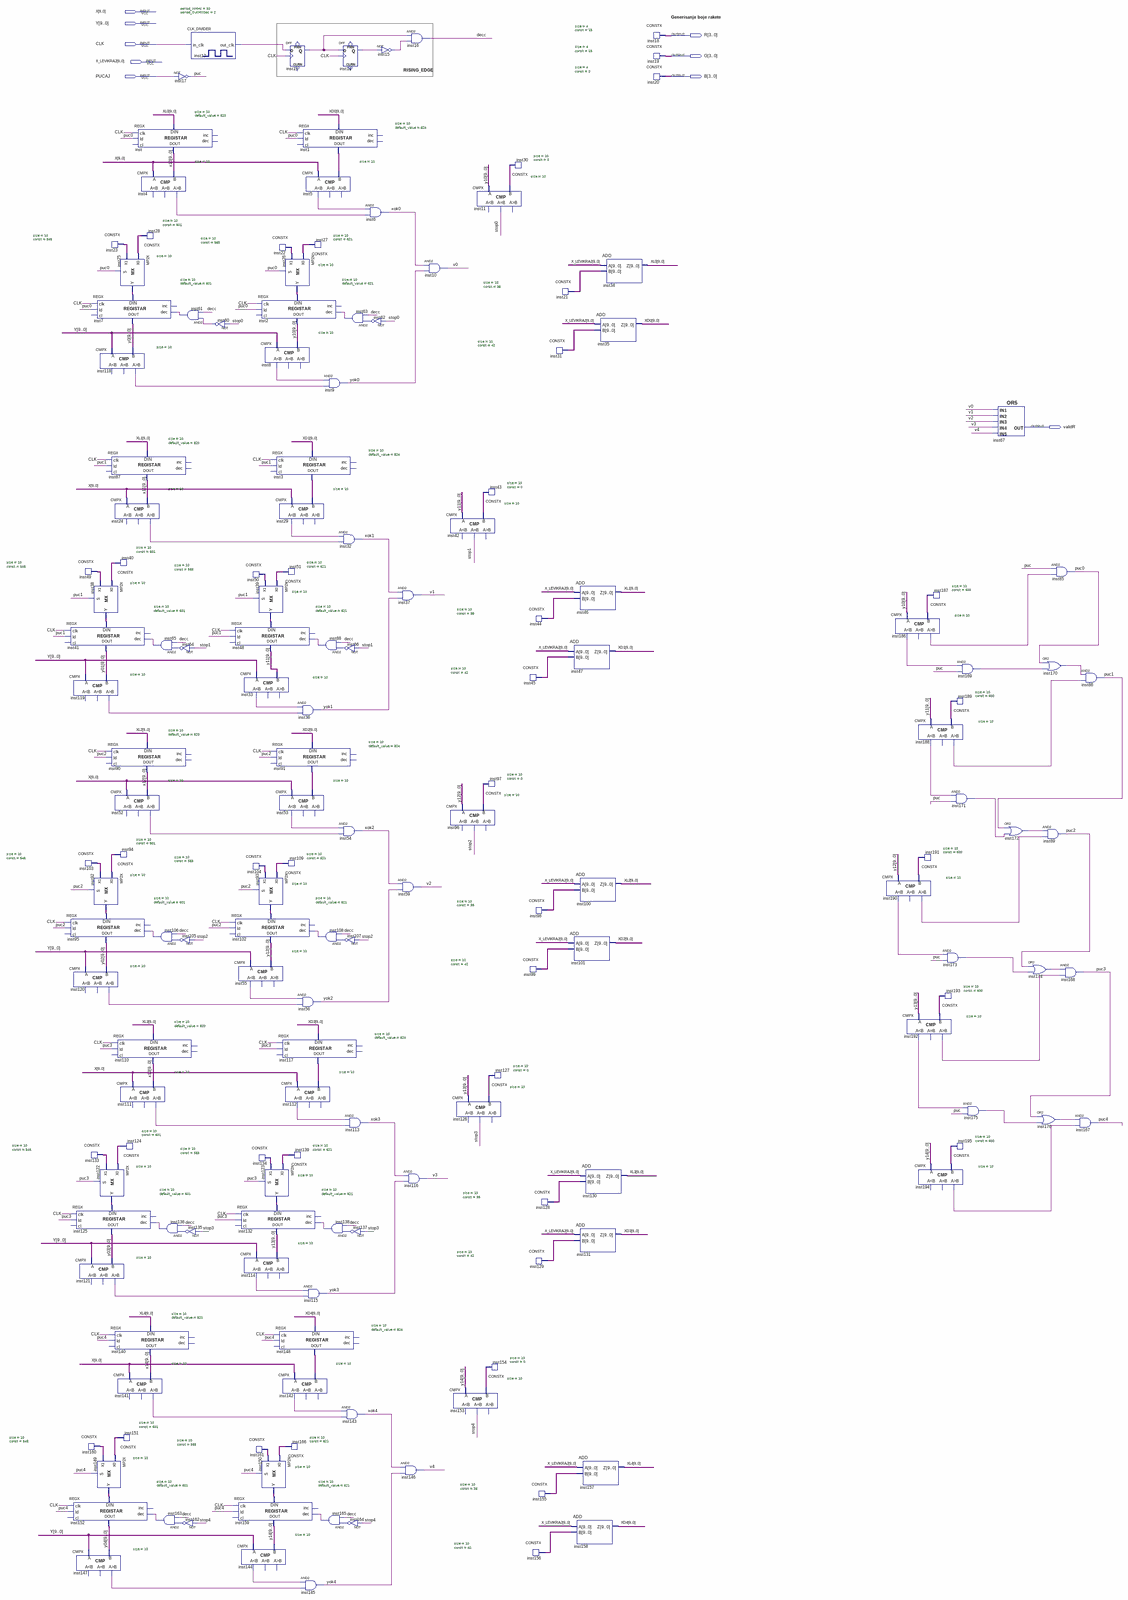
[diagram p0: schematic sheet, whole]
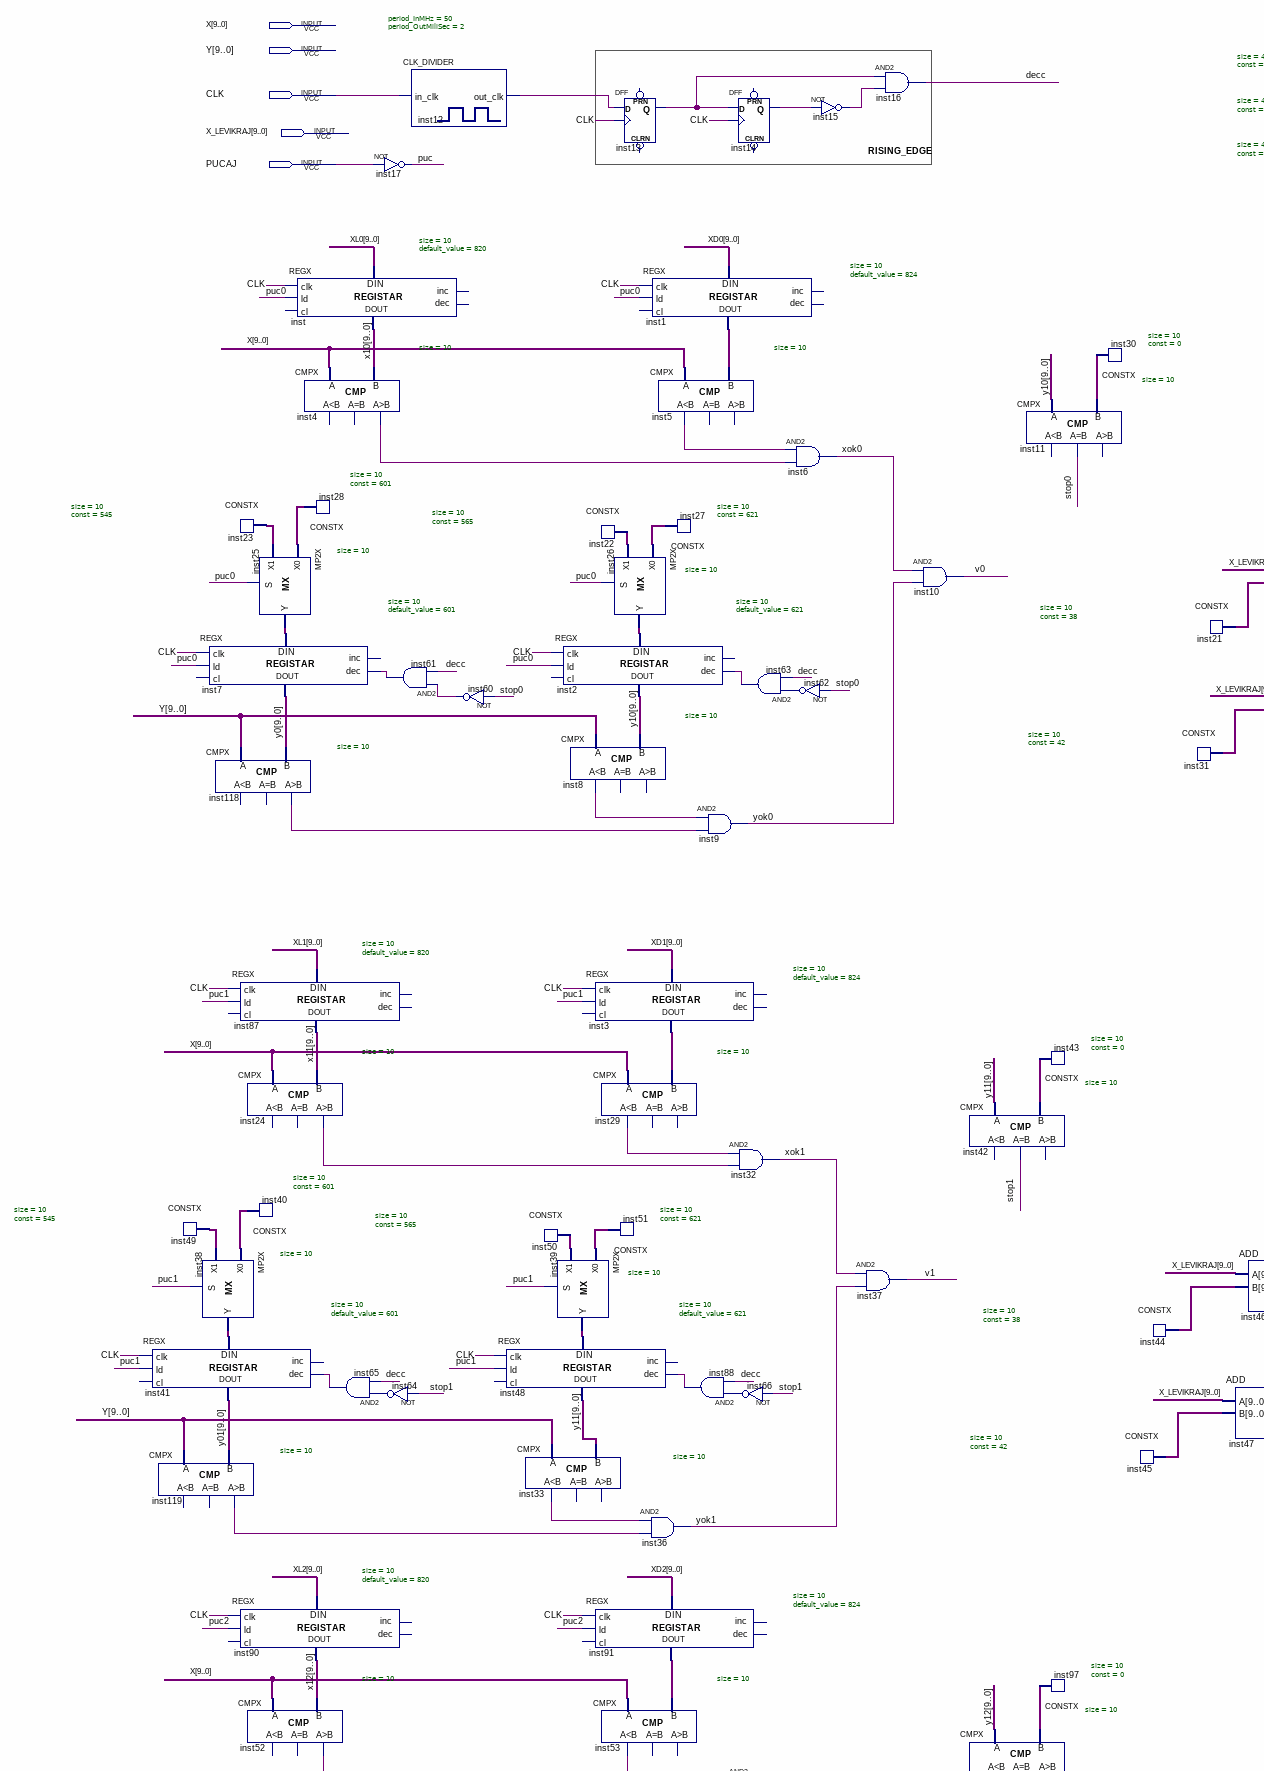
[diagram p1: schematic sheet, upper left part]
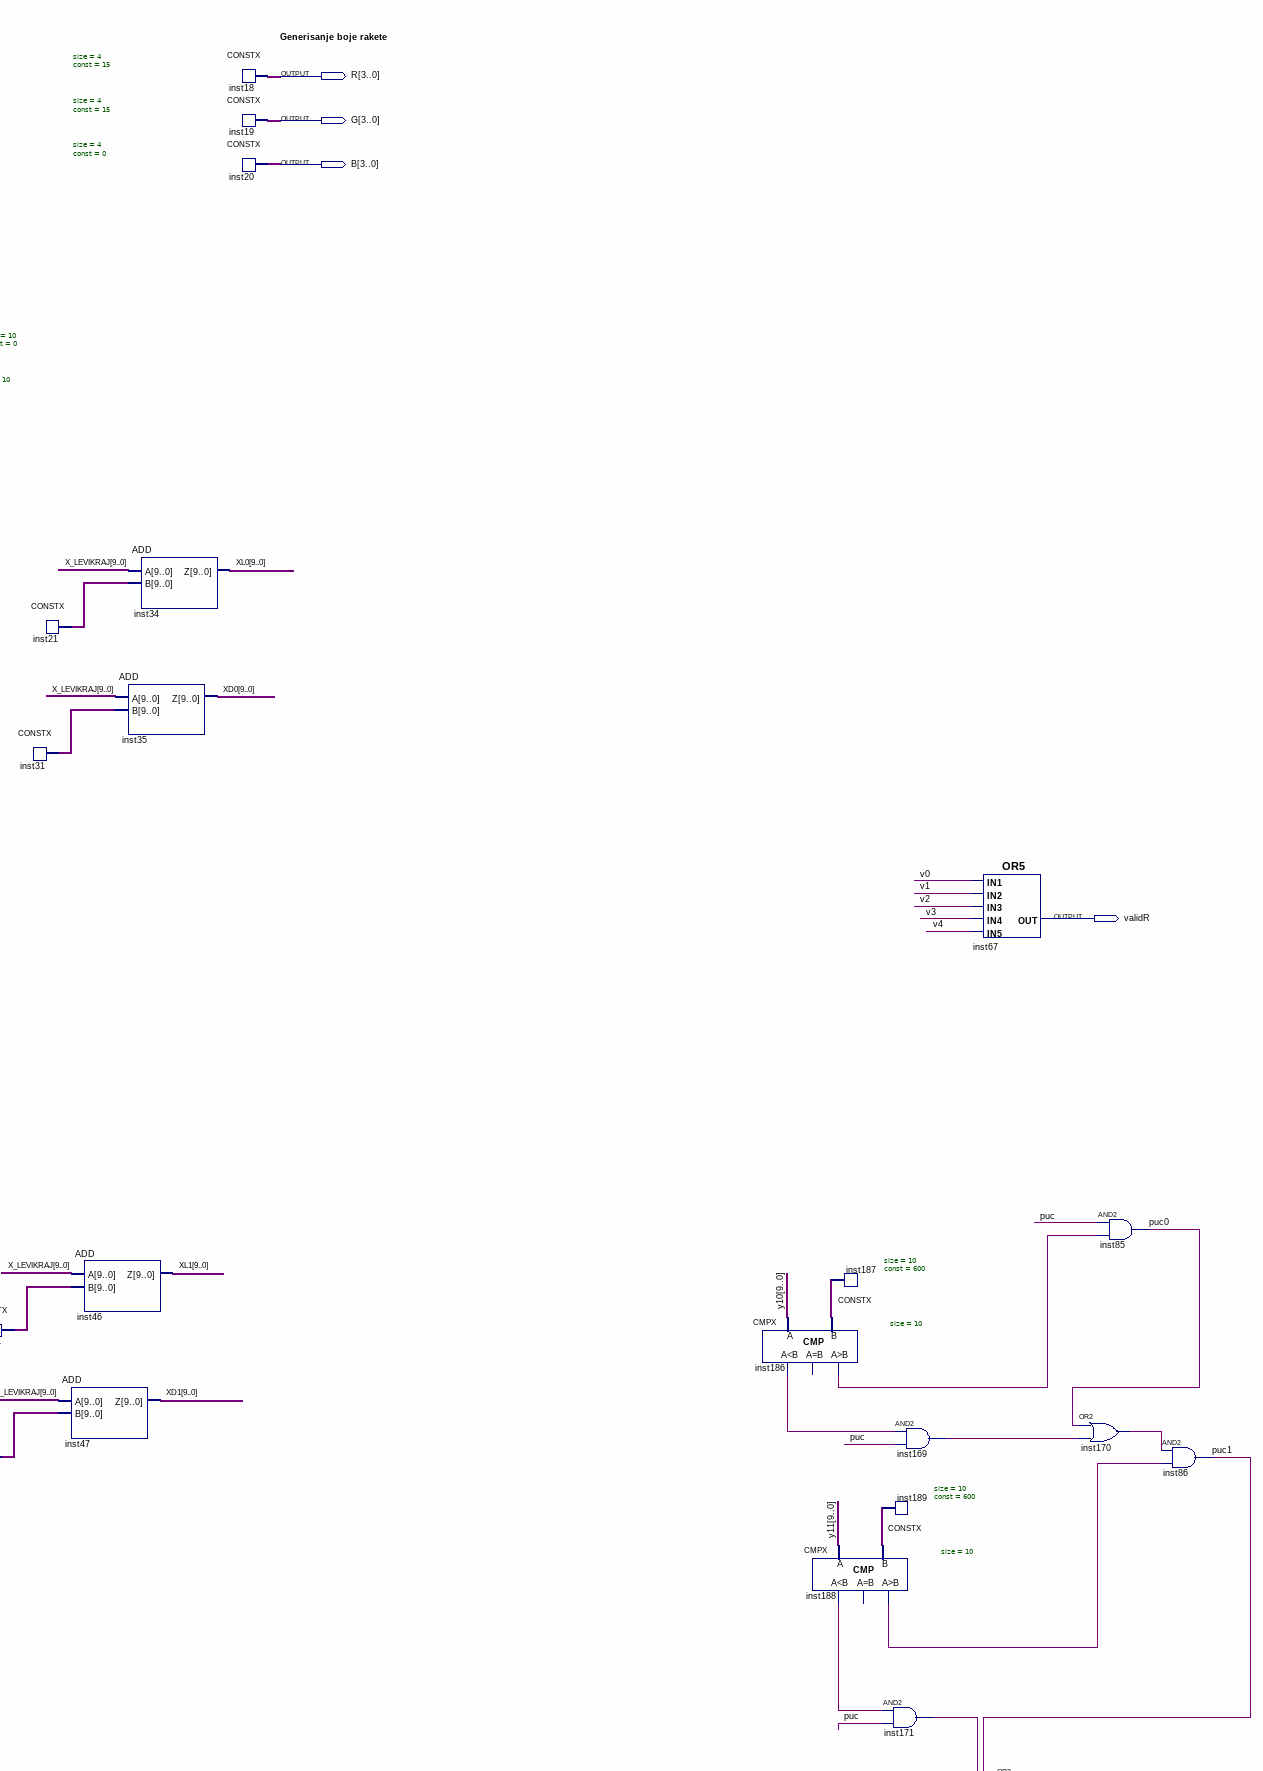
[diagram p2: schematic sheet, upper right part]
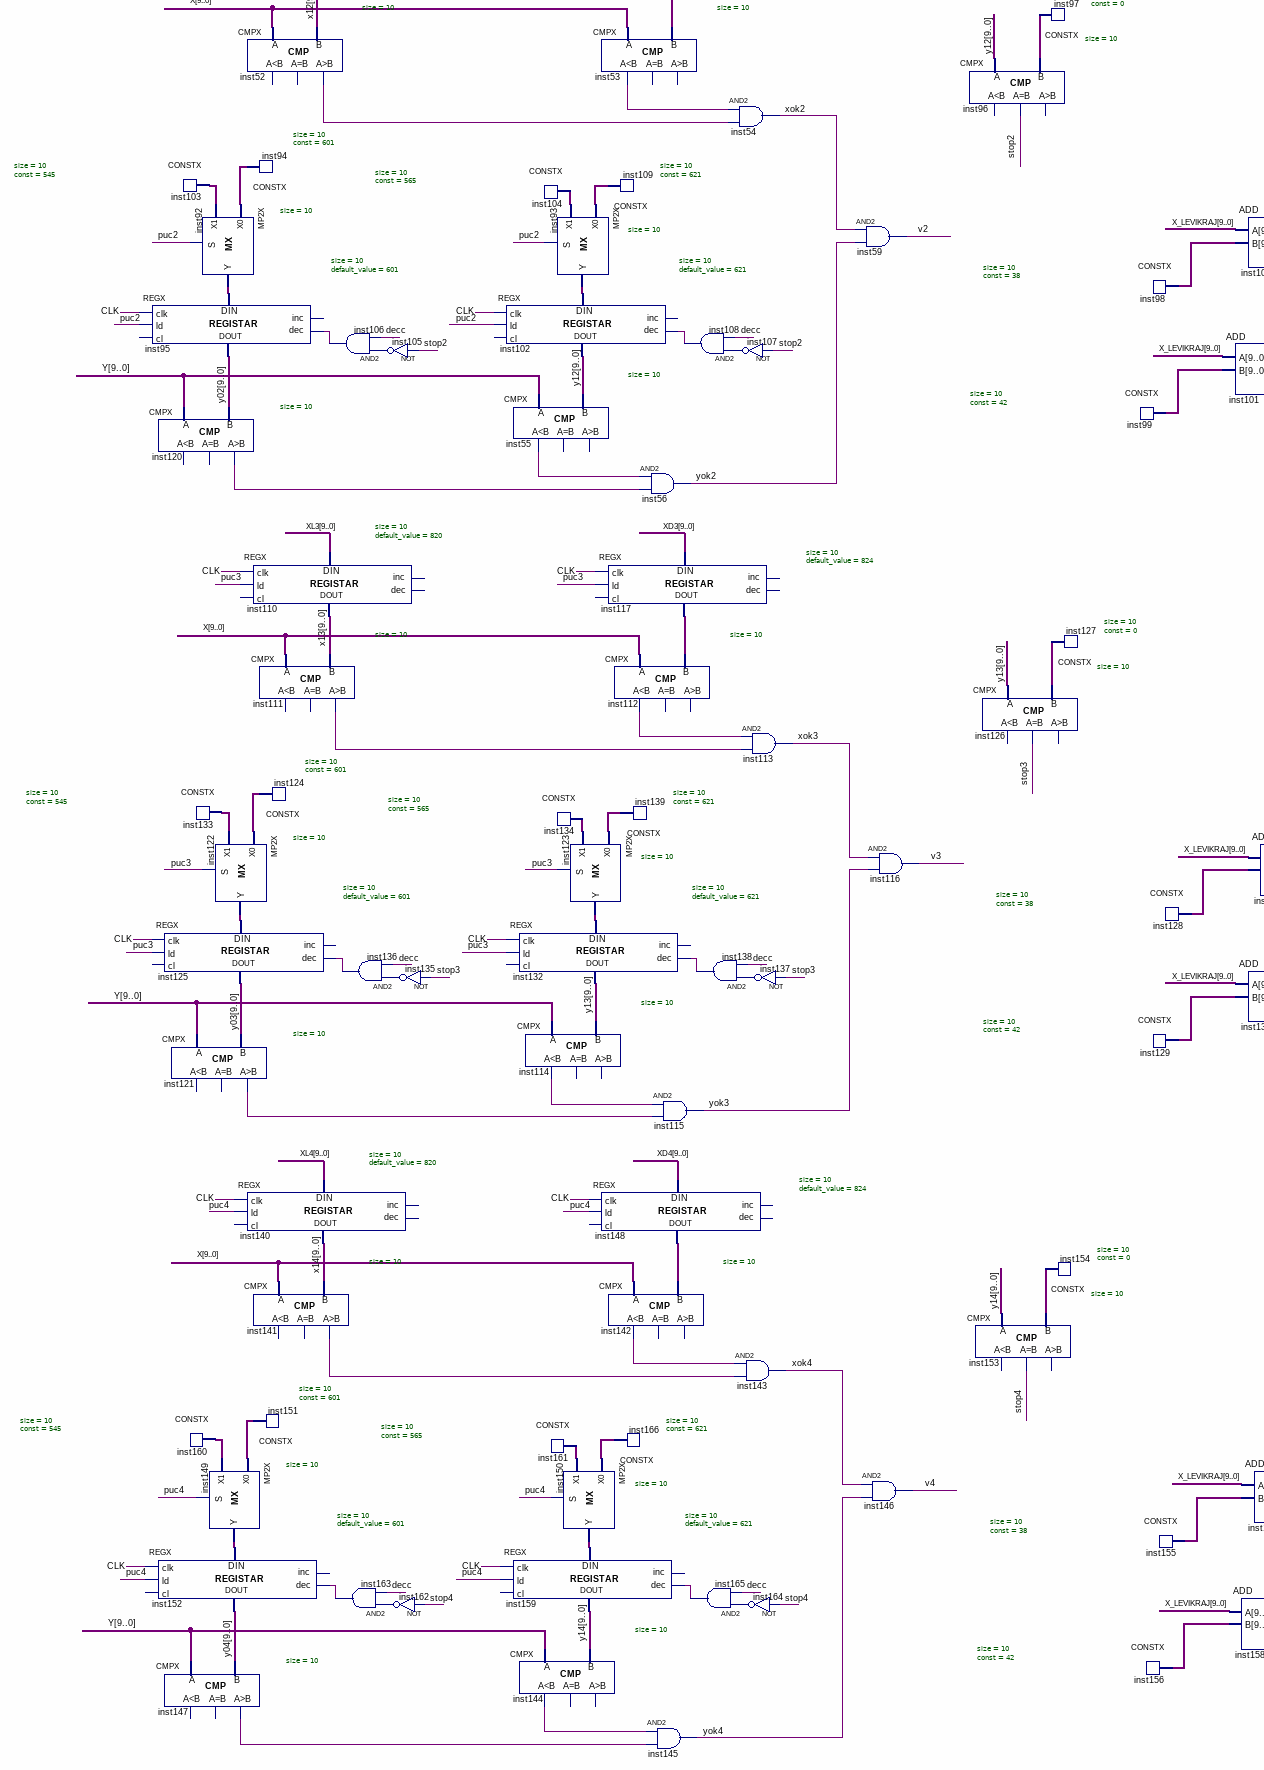
[diagram p3: schematic sheet, lower left part]
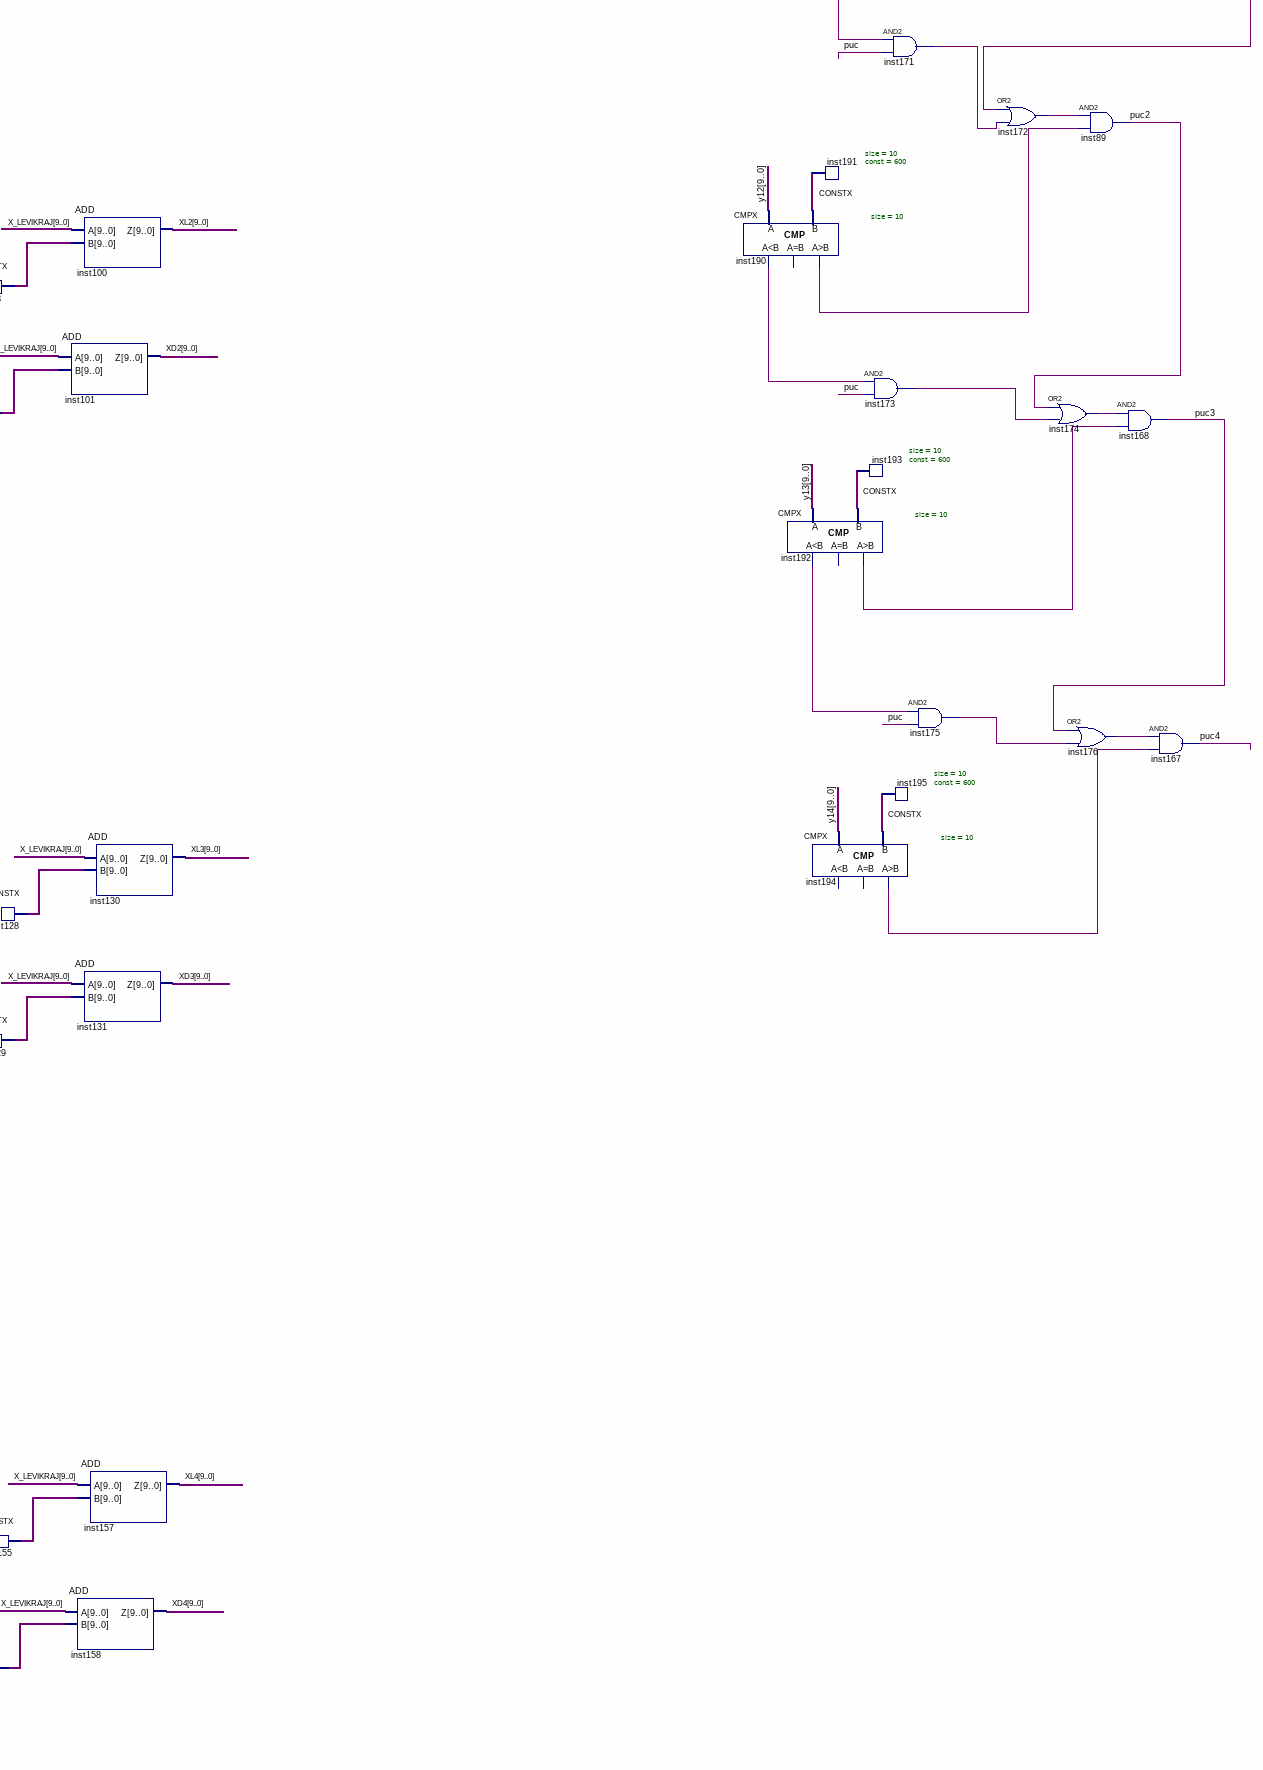
[diagram p4: schematic sheet, lower right part]
// Quartus schematic Raketa (1).bdf as structural Verilog: 168 symbols, 9 pins
module \Raketa_(1)  (
  input  [9:0] X,
  input  [9:0] Y,
  input  CLK,
  input  [9:0] X_LEVIKRAJ,
  input  PUCAJ,
  output [3:0] R,
  output [3:0] G,
  output [3:0] B,
  output validR
);

  wire decc, inst4_gr, inst5_ls, inst8_ls, inst12_out_clk, inst13_q, inst14_q, inst15_out, inst24_gr,
       inst29_ls, inst33_ls, inst52_gr, inst53_ls, inst55_ls, inst60_out, inst61_out, inst62_out, inst63_out,
       inst64_out, inst65_out, inst66_out, inst88_out, inst105_out, inst106_out, inst107_out, inst108_out,
       inst111_gr, inst112_ls, inst114_ls, inst118_gr, inst119_gr, inst120_gr, inst121_gr, inst135_out,
       inst136_out, inst137_out, inst138_out, inst141_gr, inst142_ls, inst144_ls, inst147_gr, inst162_out,
       inst163_out, inst164_out, inst165_out, inst169_out, inst170_out, inst171_out, inst172_out,
       inst173_out, inst174_out, inst175_out, inst176_out, inst186_gr, inst186_ls, inst188_gr, inst188_ls,
       inst190_gr, inst190_ls, inst192_gr, inst192_ls, inst194_gr, puc, puc0, puc1, puc2, puc3, puc4, stop0,
       stop1, stop2, stop3, stop4, v0, v1, v2, v3, v4, xok0, xok1, xok2, xok3, xok4, yok0, yok1, yok2, yok3,
       yok4;
  wire [9:0] inst1_data_out, inst3_data_out, inst21_data, inst22_data, inst23_data, inst25_y, inst26_y,
       inst27_data, inst28_data, inst30_data, inst31_data, inst38_y, inst39_y, inst40_data, inst43_data,
       inst44_data, inst45_data, inst49_data, inst50_data, inst51_data, inst91_data_out, inst92_y, inst93_y,
       inst94_data, inst97_data, inst98_data, inst99_data, inst103_data, inst104_data, inst109_data,
       inst117_data_out, inst122_y, inst123_y, inst124_data, inst127_data, inst128_data, inst129_data,
       inst133_data, inst134_data, inst139_data, inst148_data_out, inst149_y, inst150_y, inst151_data,
       inst154_data, inst155_data, inst156_data, inst160_data, inst161_data, inst166_data, inst187_data,
       inst189_data, inst191_data, inst193_data, inst195_data, x10, x11, x12, x13, x14, XD0, XD1, XD2, XD3,
       XD4, XL0, XL1, XL2, XL3, XL4, y0, y01, y02, y03, y04, y10, y11, y12, y13, y14;

  REGX #(.size(10), .default_value(601)) inst41 (
    .clk(CLK), .ld(puc1), .dec(inst65_out), .data_in(inst38_y), .data_out(y01));  // open: cl, inc
  CMPX #(.size(10)) inst119 (.A(Y), .B(y01), .gr(inst119_gr));  // open: ls, eq
  REGX #(.size(10), .default_value(601)) inst95 (
    .clk(CLK), .ld(puc2), .dec(inst106_out), .data_in(inst92_y), .data_out(y02));  // open: cl, inc
  CMPX #(.size(10)) inst120 (.A(Y), .B(y02), .gr(inst120_gr));  // open: ls, eq
  REGX #(.size(10), .default_value(601)) inst125 (
    .clk(CLK), .ld(puc3), .dec(inst136_out), .data_in(inst122_y), .data_out(y03));  // open: cl, inc
  REGX #(.size(10), .default_value(601)) inst152 (
    .clk(CLK), .ld(puc4), .dec(inst163_out), .data_in(inst149_y), .data_out(y04));  // open: cl, inc
  CMPX #(.size(10)) inst147 (.A(Y), .B(y04), .gr(inst147_gr));  // open: ls, eq
  REGX #(.size(10), .default_value(601)) inst7 (
    .clk(CLK), .ld(puc0), .dec(inst61_out), .data_in(inst25_y), .data_out(y0));  // open: cl, inc
  CMPX #(.size(10)) inst118 (.A(Y), .B(y0), .gr(inst118_gr));  // open: ls, eq
  CONSTX #(.size(10), .\const (545)) inst49 (.data(inst49_data));
  MP2X #(.size(10)) inst38 (.S(puc1), .X0(inst40_data), .X1(inst49_data), .Y(inst38_y));
  CONSTX #(.size(10), .\const (545)) inst103 (.data(inst103_data));
  MP2X #(.size(10)) inst92 (.S(puc2), .X0(inst94_data), .X1(inst103_data), .Y(inst92_y));
  CONSTX #(.size(10), .\const (545)) inst133 (.data(inst133_data));
  MP2X #(.size(10)) inst122 (.S(puc3), .X0(inst124_data), .X1(inst133_data), .Y(inst122_y));
  CMPX #(.size(10)) inst121 (.A(Y), .B(y03), .gr(inst121_gr));  // open: ls, eq
  CONSTX #(.size(10), .\const (545)) inst160 (.data(inst160_data));
  MP2X #(.size(10)) inst149 (.S(puc4), .X0(inst151_data), .X1(inst160_data), .Y(inst149_y));
  CONSTX #(.size(10), .\const (545)) inst23 (.data(inst23_data));
  MP2X #(.size(10)) inst25 (.S(puc0), .X0(inst28_data), .X1(inst23_data), .Y(inst25_y));
  REGX #(.size(10), .default_value(820)) inst87 (
    .clk(CLK), .ld(puc1), .data_in(XL1), .data_out(x11));  // open: cl, inc, dec
  CMPX #(.size(10)) inst24 (.A(X), .B(x11), .gr(inst24_gr));  // open: ls, eq
  CONSTX #(.size(10), .\const (601)) inst40 (.data(inst40_data));
  REGX #(.size(10), .default_value(820)) inst90 (
    .clk(CLK), .ld(puc2), .data_in(XL2), .data_out(x12));  // open: cl, inc, dec
  CMPX #(.size(10)) inst52 (.A(X), .B(x12), .gr(inst52_gr));  // open: ls, eq
  CONSTX #(.size(10), .\const (601)) inst94 (.data(inst94_data));
  REGX #(.size(10), .default_value(820)) inst110 (
    .clk(CLK), .ld(puc3), .data_in(XL3), .data_out(x13));  // open: cl, inc, dec
  CMPX #(.size(10)) inst111 (.A(X), .B(x13), .gr(inst111_gr));  // open: ls, eq
  REGX #(.size(10), .default_value(820)) inst140 (
    .clk(CLK), .ld(puc4), .data_in(XL4), .data_out(x14));  // open: cl, inc, dec
  CMPX #(.size(10)) inst141 (.A(X), .B(x14), .gr(inst141_gr));  // open: ls, eq
  CONSTX #(.size(10), .\const (601)) inst151 (.data(inst151_data));
  REGX #(.size(10), .default_value(820)) inst (
    .clk(CLK), .ld(puc0), .data_in(XL0), .data_out(x10));  // open: cl, inc, dec
  CMPX #(.size(10)) inst4 (.A(X), .B(x10), .gr(inst4_gr));  // open: ls, eq
  CONSTX #(.size(10), .\const (601)) inst28 (.data(inst28_data));
  CONSTX #(.size(10), .\const (601)) inst124 (.data(inst124_data));
  and inst65 (inst65_out, inst64_out, decc);
  and inst106 (inst106_out, inst105_out, decc);
  and inst136 (inst136_out, inst135_out, decc);
  and inst163 (inst163_out, inst162_out, decc);
  CLK_DIVIDER #(.period_InMHz(50), .period_OutMiliSec(2)) inst12 (.in_clk(CLK), .out_clk(inst12_out_clk));
  not inst17 (puc, PUCAJ);
  and inst61 (inst61_out, inst60_out, decc);
  not inst64 (inst64_out, stop1);
  not inst105 (inst105_out, stop2);
  not inst135 (inst135_out, stop3);
  not inst162 (inst162_out, stop4);
  not inst60 (inst60_out, stop0);
  REGX #(.size(10), .default_value(621)) inst48 (
    .clk(CLK), .ld(puc1), .dec(inst88_out), .data_in(inst39_y), .data_out(y11));  // open: cl, inc
  REGX #(.size(10), .default_value(621)) inst102 (
    .clk(CLK), .ld(puc2), .dec(inst108_out), .data_in(inst93_y), .data_out(y12));  // open: cl, inc
  CMPX #(.size(10)) inst55 (.A(Y), .B(y12), .ls(inst55_ls));  // open: eq, gr
  REGX #(.size(10), .default_value(621)) inst132 (
    .clk(CLK), .ld(puc3), .dec(inst138_out), .data_in(inst123_y), .data_out(y13));  // open: cl, inc
  REGX #(.size(10), .default_value(621)) inst159 (
    .clk(CLK), .ld(puc4), .dec(inst165_out), .data_in(inst150_y), .data_out(y14));  // open: cl, inc
  CMPX #(.size(10)) inst144 (.A(Y), .B(y14), .ls(inst144_ls));  // open: eq, gr
  REGX #(.size(10), .default_value(621)) inst2 (
    .clk(CLK), .ld(puc0), .dec(inst63_out), .data_in(inst26_y), .data_out(y10));  // open: cl, inc
  CMPX #(.size(10)) inst8 (.A(Y), .B(y10), .ls(inst8_ls));  // open: eq, gr
  CONSTX #(.size(10), .\const (565)) inst50 (.data(inst50_data));
  MP2X #(.size(10)) inst39 (.S(puc1), .X0(inst51_data), .X1(inst50_data), .Y(inst39_y));
  CMPX #(.size(10)) inst33 (.A(Y), .B(y11), .ls(inst33_ls));  // open: eq, gr
  CONSTX #(.size(10), .\const (565)) inst104 (.data(inst104_data));
  MP2X #(.size(10)) inst93 (.S(puc2), .X0(inst109_data), .X1(inst104_data), .Y(inst93_y));
  CONSTX #(.size(10), .\const (565)) inst134 (.data(inst134_data));
  MP2X #(.size(10)) inst123 (.S(puc3), .X0(inst139_data), .X1(inst134_data), .Y(inst123_y));
  CMPX #(.size(10)) inst114 (.A(Y), .B(y13), .ls(inst114_ls));  // open: eq, gr
  CONSTX #(.size(10), .\const (565)) inst161 (.data(inst161_data));
  MP2X #(.size(10)) inst150 (.S(puc4), .X0(inst166_data), .X1(inst161_data), .Y(inst150_y));
  CONSTX #(.size(10), .\const (565)) inst22 (.data(inst22_data));
  MP2X #(.size(10)) inst26 (.S(puc0), .X0(inst27_data), .X1(inst22_data), .Y(inst26_y));
  REGX #(.size(10), .default_value(824)) inst3 (
    .clk(CLK), .ld(puc1), .data_in(XD1), .data_out(inst3_data_out));  // open: cl, inc, dec
  CMPX #(.size(10)) inst29 (.A(X), .B(inst3_data_out), .ls(inst29_ls));  // open: eq, gr
  CONSTX #(.size(10), .\const (621)) inst51 (.data(inst51_data));
  REGX #(.size(10), .default_value(824)) inst91 (
    .clk(CLK), .ld(puc2), .data_in(XD2), .data_out(inst91_data_out));  // open: cl, inc, dec
  CMPX #(.size(10)) inst53 (.A(X), .B(inst91_data_out), .ls(inst53_ls));  // open: eq, gr
  CONSTX #(.size(10), .\const (621)) inst109 (.data(inst109_data));
  REGX #(.size(10), .default_value(824)) inst117 (
    .clk(CLK), .ld(puc3), .data_in(XD3), .data_out(inst117_data_out));  // open: cl, inc, dec
  CMPX #(.size(10)) inst112 (.A(X), .B(inst117_data_out), .ls(inst112_ls));  // open: eq, gr
  REGX #(.size(10), .default_value(824)) inst148 (
    .clk(CLK), .ld(puc4), .data_in(XD4), .data_out(inst148_data_out));  // open: cl, inc, dec
  CMPX #(.size(10)) inst142 (.A(X), .B(inst148_data_out), .ls(inst142_ls));  // open: eq, gr
  DFF inst13 (.CLK(CLK), .D(inst12_out_clk), .Q(inst13_q));  // open: CLRN, PRN
  REGX #(.size(10), .default_value(824)) inst1 (
    .clk(CLK), .ld(puc0), .data_in(XD0), .data_out(inst1_data_out));  // open: cl, inc, dec
  CMPX #(.size(10)) inst5 (.A(X), .B(inst1_data_out), .ls(inst5_ls));  // open: eq, gr
  and inst36 (yok1, inst33_ls, inst119_gr);
  and inst56 (yok2, inst55_ls, inst120_gr);
  CONSTX #(.size(10), .\const (621)) inst139 (.data(inst139_data));
  and inst115 (yok3, inst114_ls, inst121_gr);
  CONSTX #(.size(10), .\const (621)) inst166 (.data(inst166_data));
  and inst145 (yok4, inst144_ls, inst147_gr);
  CONSTX #(.size(10), .\const (621)) inst27 (.data(inst27_data));
  and inst9 (yok0, inst8_ls, inst118_gr);
  and inst88 (inst88_out, inst66_out, decc);
  and inst108 (inst108_out, inst107_out, decc);
  and inst138 (inst138_out, inst137_out, decc);
  and inst165 (inst165_out, inst164_out, decc);
  DFF inst14 (.CLK(CLK), .D(inst13_q), .Q(inst14_q));  // open: CLRN, PRN
  and inst63 (inst63_out, inst62_out, decc);
  and inst32 (xok1, inst29_ls, inst24_gr);
  not inst66 (inst66_out, stop1);
  and inst54 (xok2, inst53_ls, inst52_gr);
  not inst107 (inst107_out, stop2);
  and inst113 (xok3, inst112_ls, inst111_gr);
  not inst137 (inst137_out, stop3);
  and inst143 (xok4, inst142_ls, inst141_gr);
  not inst164 (inst164_out, stop4);
  not inst15 (inst15_out, inst14_q);
  and inst6 (xok0, inst5_ls, inst4_gr);
  not inst62 (inst62_out, stop0);
  and inst37 (v1, xok1, yok1);
  and inst59 (v2, xok2, yok2);
  and inst146 (v4, xok4, yok4);
  and inst16 (decc, inst13_q, inst15_out);
  and inst10 (v0, xok0, yok0);
  and inst116 (v3, xok3, yok3);
  CMPX #(.size(10)) inst42 (.A(y11), .B(inst43_data), .eq(stop1));  // open: ls, gr
  CMPX #(.size(10)) inst96 (.A(y12), .B(inst97_data), .eq(stop2));  // open: ls, gr
  CMPX #(.size(10)) inst153 (.A(y14), .B(inst154_data), .eq(stop4));  // open: ls, gr
  CMPX #(.size(10)) inst11 (.A(y10), .B(inst30_data), .eq(stop0));  // open: ls, gr
  CMPX #(.size(10)) inst126 (.A(y13), .B(inst127_data), .eq(stop3));  // open: ls, gr
  CONSTX #(.size(10), .\const (0)) inst43 (.data(inst43_data));
  CONSTX #(.size(10), .\const (0)) inst97 (.data(inst97_data));
  CONSTX #(.size(10), .\const (0)) inst127 (.data(inst127_data));
  CONSTX #(.size(10), .\const (0)) inst154 (.data(inst154_data));
  CONSTX #(.size(10), .\const (0)) inst30 (.data(inst30_data));
  CONSTX #(.size(10), .\const (38)) inst44 (.data(inst44_data));
  CONSTX #(.size(10), .\const (42)) inst45 (.data(inst45_data));
  CONSTX #(.size(10), .\const (38)) inst98 (.data(inst98_data));
  CONSTX #(.size(10), .\const (42)) inst99 (.data(inst99_data));
  CONSTX #(.size(10), .\const (38)) inst128 (.data(inst128_data));
  CONSTX #(.size(10), .\const (42)) inst129 (.data(inst129_data));
  CONSTX #(.size(10), .\const (38)) inst155 (.data(inst155_data));
  CONSTX #(.size(10), .\const (42)) inst156 (.data(inst156_data));
  CONSTX #(.size(10), .\const (38)) inst21 (.data(inst21_data));
  CONSTX #(.size(10), .\const (42)) inst31 (.data(inst31_data));
  ADD inst46 (.A(X_LEVIKRAJ), .B(inst44_data), .Z(XL1));
  ADD inst47 (.A(X_LEVIKRAJ), .B(inst45_data), .Z(XD1));
  ADD inst100 (.A(X_LEVIKRAJ), .B(inst98_data), .Z(XL2));
  ADD inst101 (.A(X_LEVIKRAJ), .B(inst99_data), .Z(XD2));
  ADD inst130 (.A(X_LEVIKRAJ), .B(inst128_data), .Z(XL3));
  ADD inst131 (.A(X_LEVIKRAJ), .B(inst129_data), .Z(XD3));
  ADD inst157 (.A(X_LEVIKRAJ), .B(inst155_data), .Z(XL4));
  ADD inst158 (.A(X_LEVIKRAJ), .B(inst156_data), .Z(XD4));
  ADD inst34 (.A(X_LEVIKRAJ), .B(inst21_data), .Z(XL0));
  ADD inst35 (.A(X_LEVIKRAJ), .B(inst31_data), .Z(XD0));
  CONSTX #(.size(4), .\const (15)) inst18 (.data(R));
  CONSTX #(.size(4), .\const (15)) inst19 (.data(G));
  CONSTX #(.size(4), .\const (0)) inst20 (.data(B));
  CMPX #(.size(10)) inst186 (.A(y10), .B(inst187_data), .ls(inst186_ls), .gr(inst186_gr));  // open: eq
  CMPX #(.size(10)) inst190 (.A(y12), .B(inst191_data), .ls(inst190_ls), .gr(inst190_gr));  // open: eq
  CMPX #(.size(10)) inst188 (.A(y11), .B(inst189_data), .ls(inst188_ls), .gr(inst188_gr));  // open: eq
  CONSTX #(.size(10), .\const (600)) inst191 (.data(inst191_data));
  CMPX #(.size(10)) inst192 (.A(y13), .B(inst193_data), .ls(inst192_ls), .gr(inst192_gr));  // open: eq
  CMPX #(.size(10)) inst194 (.A(y14), .B(inst195_data), .gr(inst194_gr));  // open: ls, eq
  CONSTX #(.size(10), .\const (600)) inst187 (.data(inst187_data));
  and inst173 (inst173_out, inst190_ls, puc);
  CONSTX #(.size(10), .\const (600)) inst193 (.data(inst193_data));
  and inst169 (inst169_out, inst186_ls, puc);
  CONSTX #(.size(10), .\const (600)) inst189 (.data(inst189_data));
  and inst171 (inst171_out, inst188_ls, puc);
  and inst175 (inst175_out, inst192_ls, puc);
  CONSTX #(.size(10), .\const (600)) inst195 (.data(inst195_data));
  or inst67 (validR, v0, v1, v2, v3, v4);
  or inst172 (inst172_out, puc1, inst171_out);
  or inst174 (inst174_out, puc2, inst173_out);
  or inst176 (inst176_out, puc3, inst175_out);
  and inst85 (puc0, puc, inst186_gr);
  or inst170 (inst170_out, puc0, inst169_out);
  and inst89 (puc2, inst172_out, inst190_gr);
  and inst168 (puc3, inst174_out, inst192_gr);
  and inst86 (puc1, inst170_out, inst188_gr);
  and inst167 (puc4, inst176_out, inst194_gr);

  // Notes on the sheet:
  //   Generisanje boje rakete
  //   RISING_EDGE
endmodule
